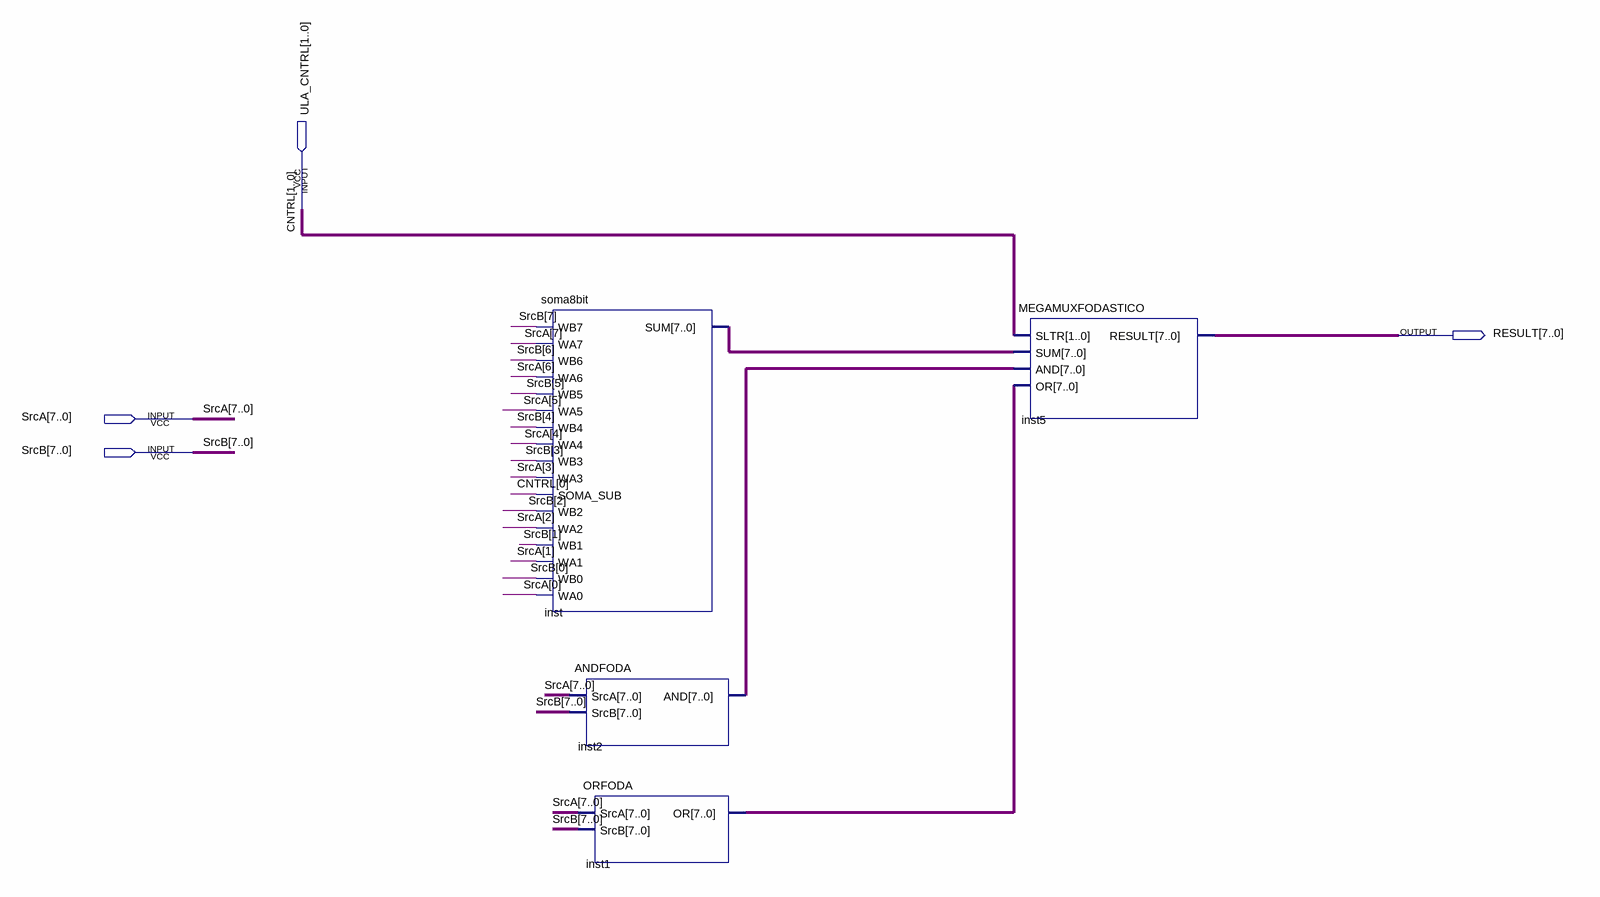
[diagram p0: schematic sheet]
// Quartus schematic ULA.bdf as structural Verilog: 4 symbols, 4 pins
module ULA (
  input  [1:0] ULA_CNTRL,
  input  [7:0] SrcA,
  input  [7:0] SrcB,
  output [7:0] RESULT
);

  wire [7:0] inst1_or, inst2_and, inst_sum;

  soma8bit inst (
    .WB7(SrcB[7]), .WA7(SrcA[7]), .WB6(SrcB[6]), .WA6(SrcA[6]), .WB5(SrcB[5]), .WA5(SrcA[5]), .WB4(SrcB[4]),
    .WA4(SrcA[4]), .WB3(SrcB[3]), .WA3(SrcA[3]), .SOMA_SUB(ULA_CNTRL[0]), .WB2(SrcB[2]), .WA2(SrcA[2]),
    .WB1(SrcB[1]), .WA1(SrcA[1]), .WB0(SrcB[0]), .WA0(SrcA[0]), .SUM(inst_sum));
  ANDFODA inst2 (.SrcA(SrcA), .SrcB(SrcB), .AND(inst2_and));
  ORFODA inst1 (.SrcA(SrcA), .SrcB(SrcB), .OR(inst1_or));
  MEGAMUXFODASTICO inst5 (.SLTR(ULA_CNTRL), .SUM(inst_sum), .AND(inst2_and), .OR(inst1_or), .RESULT(RESULT));

  // Other names for the same wires on the sheet: CNTRL[1:0] = ULA_CNTRL
endmodule
